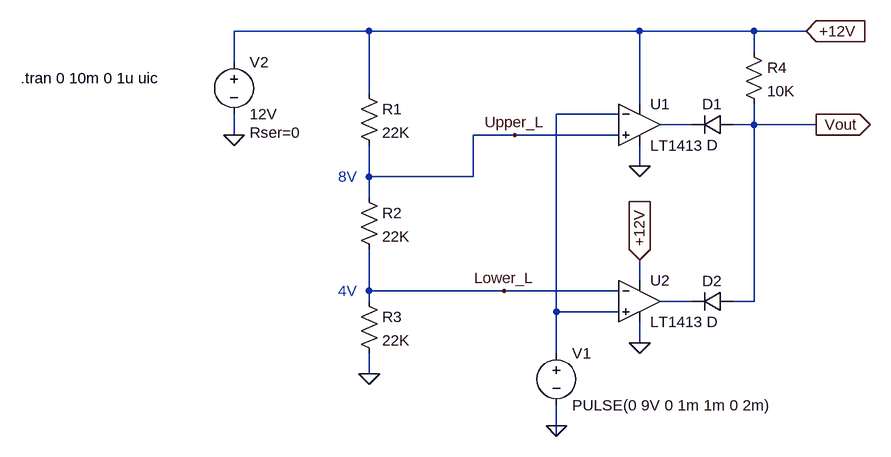
[diagram p0: schematic Op-Amp Window Comparator.asc]
Op-Amp Window Comparator.asc, the LTspice schematic file:
Version 4.1
SHEET 1 880 724
WIRE -256 96 -464 96
WIRE 160 96 -256 96
WIRE 336 96 160 96
WIRE 416 96 336 96
WIRE 336 128 336 96
WIRE -464 144 -464 96
WIRE -256 192 -256 96
WIRE 160 208 160 96
WIRE 128 224 32 224
WIRE 240 240 192 240
WIRE 336 240 336 208
WIRE 336 240 304 240
WIRE 432 240 336 240
WIRE -464 256 -464 224
WIRE -32 256 -96 256
WIRE 128 256 -32 256
WIRE 160 304 160 272
WIRE -256 320 -256 272
WIRE -96 320 -96 256
WIRE -96 320 -256 320
WIRE -256 352 -256 320
WIRE 160 480 160 448
WIRE -256 496 -256 432
WIRE -48 496 -256 496
WIRE 128 496 -48 496
WIRE -256 512 -256 496
WIRE 240 512 192 512
WIRE 336 512 336 240
WIRE 336 512 304 512
WIRE 32 528 32 224
WIRE 128 528 32 528
WIRE 160 576 160 544
WIRE 32 592 32 528
WIRE -256 624 -256 592
WIRE 32 704 32 672
WIRE 32 720 32 704
FLAG -256 624 0
FLAG -464 256 0
FLAG 160 576 0
FLAG 32 704 0
FLAG 416 96 +12V
IOPIN 416 96 In
FLAG 160 448 +12V
IOPIN 160 448 In
FLAG 432 240 Vout
IOPIN 432 240 Out
FLAG 160 304 0
FLAG -32 256 Upper_L
FLAG -48 496 Lower_L
SYMBOL OpAmps\\LT1413 160 176 R0
SYMATTR InstName U1
SYMBOL voltage 32 576 R0
WINDOW 123 0 0 Left 0
WINDOW 39 0 0 Left 0
SYMATTR InstName V1
SYMATTR Value PULSE(0 9V 0 1m 1m 0 2m)
SYMBOL voltage -464 128 R0
WINDOW 123 0 0 Left 0
WINDOW 39 24 124 Left 2
SYMATTR InstName V2
SYMATTR Value 12V
SYMATTR SpiceLine Rser=0
SYMBOL OpAmps\\LT1413 160 448 R0
SYMATTR InstName U2
SYMBOL res -272 176 R0
SYMATTR InstName R1
SYMATTR Value 22K
SYMBOL res -272 336 R0
SYMATTR InstName R2
SYMATTR Value 22K
SYMBOL res -272 496 R0
SYMATTR InstName R3
SYMATTR Value 22K
SYMBOL res 320 112 R0
SYMATTR InstName R4
SYMATTR Value 10K
SYMBOL diode 304 224 R90
WINDOW 0 0 32 VBottom 2
WINDOW 3 32 32 VTop 2
SYMATTR InstName D1
SYMBOL diode 304 496 R90
WINDOW 0 0 32 VBottom 2
WINDOW 3 32 32 VTop 2
SYMATTR InstName D2
TEXT -304 320 Left 2 ;8V
TEXT -304 496 Left 2 ;4V
TEXT -792 168 Left 2 !.tran 0 10m 0 1u uic

The netlist it stands for:
* Op-Amp Window Comparator.asc
X§U1 Upper_L N001 +12V 0 N002 LT1413  ; pins In+ In- V+ V- OUT
V1 N001 0 PULSE(0 9V 0 1m 1m 0 2m)
V2 +12V 0 12V Rser=0
X§U2 N001 Lower_L +12V 0 N003 LT1413  ; pins In+ In- V+ V- OUT
R1 +12V Upper_L 22K
R2 Upper_L Lower_L 22K
R3 Lower_L 0 22K
R4 +12V Vout 10K
D1 Vout N002 D
D2 Vout N003 D
.model D D
.lib standard.dio
* 8V
* 4V
.tran 0 10m 0 1u uic
.lib LTC.lib
.backanno
.end